# EAGLE design RCDongle (EAGLE 6.5.0)
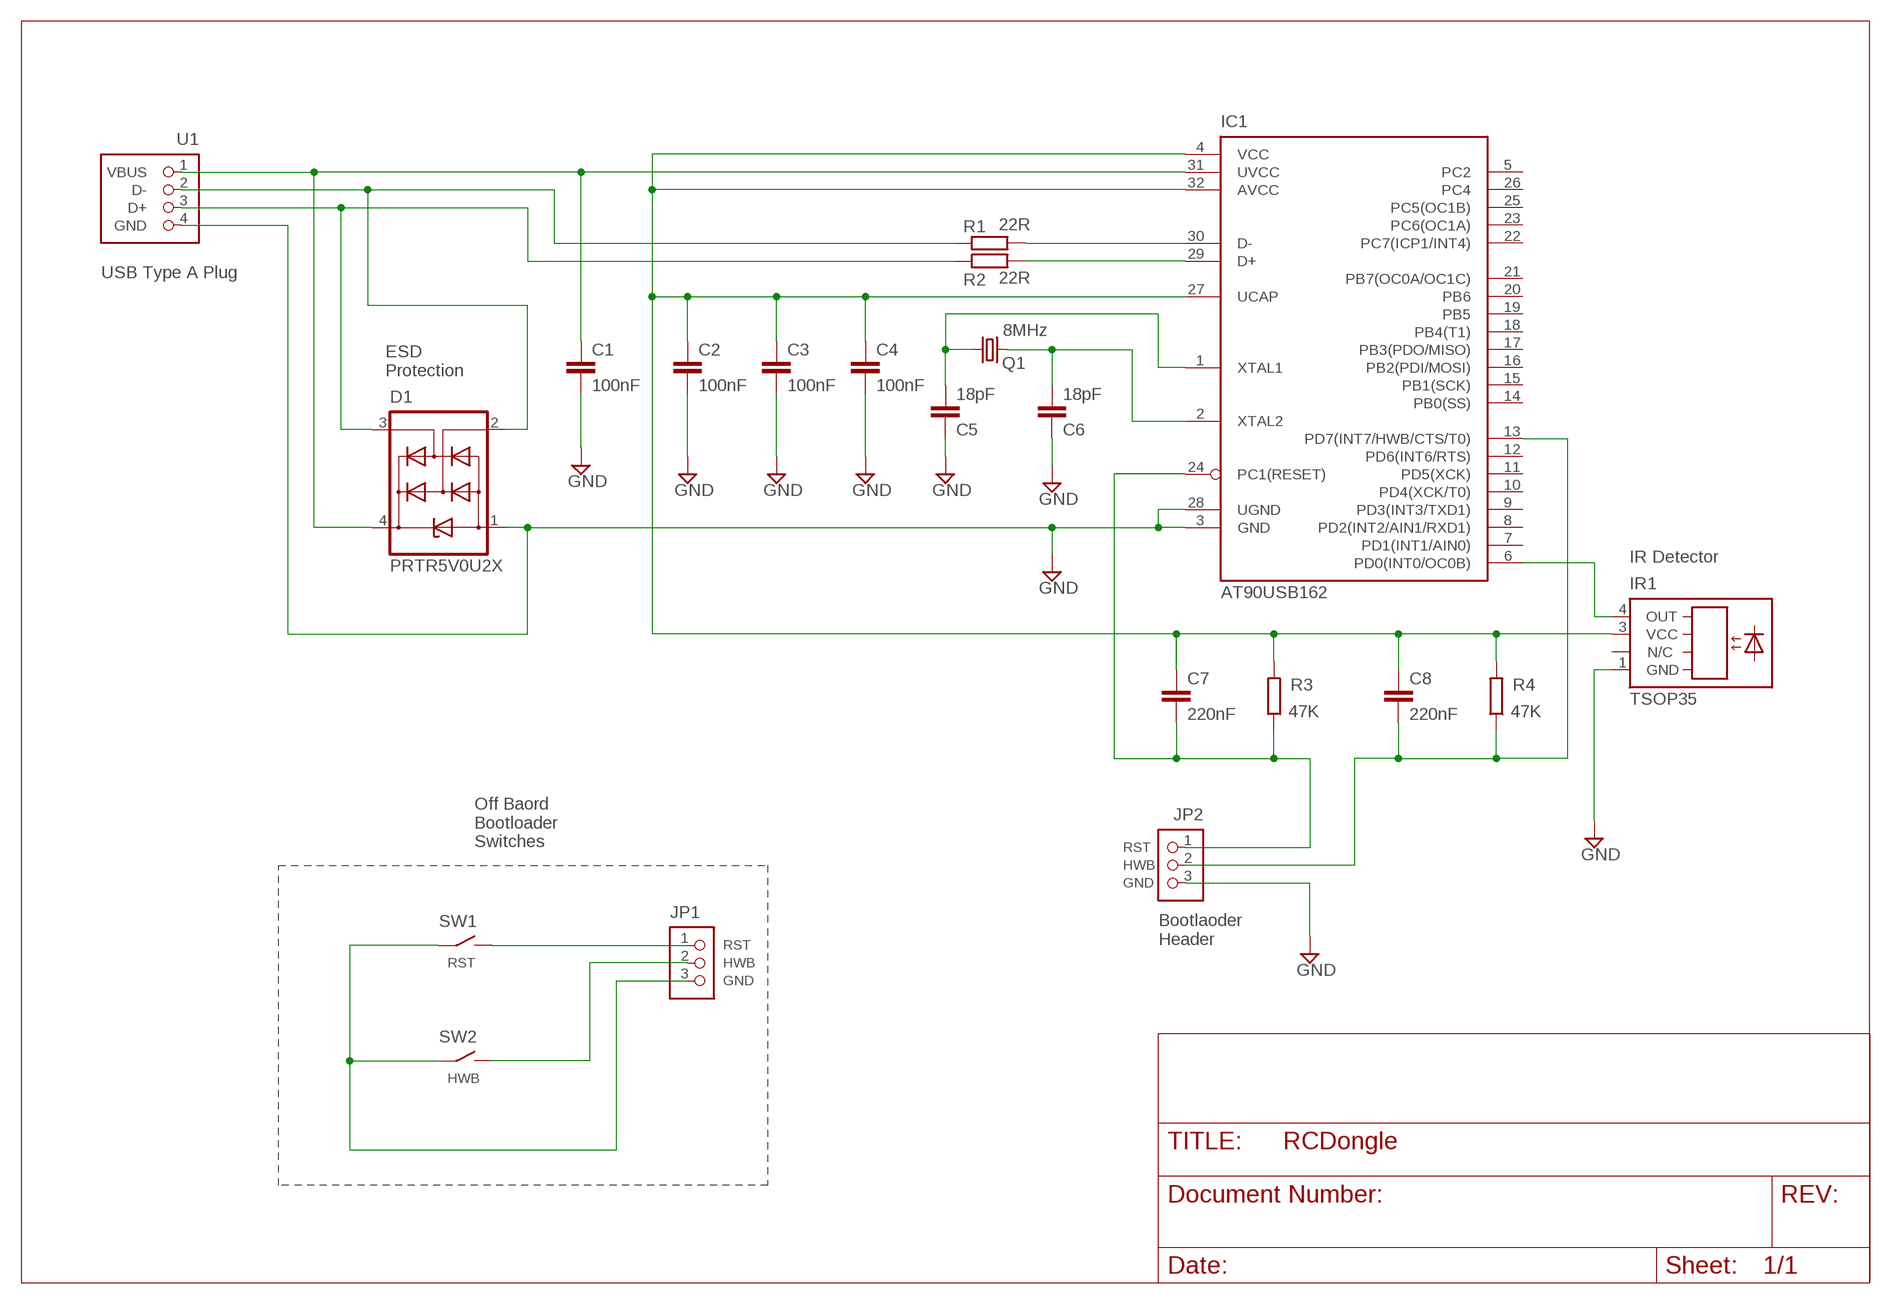
[diagram p0: schematic, sheet 1]

## Parts
C1  100nF  C-EUC0805  [C0805]
C2  100nF  C-EUC0805  [C0805]
C3  100nF  C-EUC0805  [C0805]
C4  100nF  C-EUC0805  [C0805]
C5  18pF  C-EUC0805  [C0805]
C6  18pF  C-EUC0805  [C0805]
C7  220nF  C-EUC0805  [C0805]
C8  220nF  C-EUC0805  [C0805]
D1  PRTR5V0U2X  [P-SOT143BE]
IC1  AT90USB162  [P-TQFP32]
IR1  TSOP35  [P-TSOP35]
JP1  HEADER-1X03  [P-1X03]
JP2  HEADER-1X03  [P-1X03]
Q1  8MHz  CSM-7X-DU  [CSM-7X-DU]
R1  22R  R-EU_M0805  [M0805]
R2  22R  R-EU_M0805  [M0805]
R3  47K  R-EU_M0805  [M0805]
R4  47K  R-EU_M0805  [M0805]
SW1  SWITCH-2PIN  [P-SWITCH-SMT-DTSM31NV]
SW2  SWITCH-2PIN  [P-SWITCH-SMT-DTSM31NV]
U1  USB-TYPEA-PLUG  [P-USB-TYPEA-PLUG]

## Nets
GND: C1.2 C2.2 C3.2 C4.2 C5.1 C6.1 D1.1 IC1.3(GND) IC1.28(UGND) IR1.1(GND) JP2.3 U1.4(GND)
N$1: C5.2 IC1.1(XTAL1) Q1.2
N$2: C6.2 IC1.2(XTAL2) Q1.1
N$3: IC1.30(D-) R1.2
N$4: IC1.29(D+) R2.2
N$5: JP1.1 SW1.2
N$6: JP1.2 SW2.2
N$7: D1.3 R2.1 U1.3(D+)
N$8: D1.2 R1.1 U1.2(D-)
N$9: C8.2 IC1.13(PD7(INT7/HWB/CTS/T0)) JP2.2 R4.1
N$10: C1.1 D1.4 IC1.31(UVCC) U1.1(VBUS)
N$11: C7.2 IC1.24(PC1(RESET)) JP2.1 R3.1
N$12: JP1.3 SW1.1 SW2.1
N$14: C2.1 C3.1 C4.1 C7.1 C8.1 IC1.4(VCC) IC1.27(UCAP) IC1.32(AVCC) IR1.3(VCC) R3.2 R4.2
N$30: IC1.6(PD0(INT0/OC0B)) IR1.4(OUT)
Unconnected: IC1.5(PC2) IC1.7(PD1(INT1/AIN0)) IC1.8(PD2(INT2/AIN1/RXD1)) IC1.9(PD3(INT3/TXD1)) IC1.10(PD4(XCK/T0)) IC1.11(PD5(XCK)) IC1.12(PD6(INT6/RTS)) IC1.14(PB0(SS)) IC1.15(PB1(SCK)) IC1.16(PB2(PDI/MOSI)) IC1.17(PB3(PDO/MISO)) IC1.18(PB4(T1)) IC1.19(PB5) IC1.20(PB6) IC1.21(PB7(OC0A/OC1C)) IC1.22(PC7(ICP1/INT4)) IC1.23(PC6(OC1A)) IC1.25(PC5(OC1B)) IC1.26(PC4)

## Notes on the sheet
- USB Type A Plug
- ESD
  Protection
- IR Detector
- Off Baord
  Bootloader
  Switches
- RST
- HWB
- GND
- RST
- Bootlaoder
  Header
- RST | HWB
- GND
- HWB

## Library data of the parts
C1-C8 = rcl:C-EU: CAPACITOR, European symbol
D1 = dn-electronics:PRTR5V0U2X: PRTR5V0U2X ESD Protection Diode Farnell - 1524157 RS - 7258720
IC1 = dn-electronics:AT90USB162: AT90USB162 TQFP32: Farnell - 1455073 TQFP32: RS - 7153750
IR1 = dn-electronics:TSOP35: TSOP35 IR Detector Farnell - 2251345 RS - 7103878
JP1 JP2 = dn-electronics:HEADER-1X03: Header 1x03 36 way single row: JPR - 710360
Q1 = crystal:CSM-7X-DU: SMD CRYSTAL Source: www.ecsxtal.com .. Crystal 3.6864MHz CSM_7X_DU.PDF; OC_FARNELL: unknown; OC_NEWARK: unknown
R1-R4 = resistor:R-EU_: RESISTOR, European symbol
SW1 SW2 = dn-electronics:SWITCH-2PIN: Switches 2 Pin SMT Tactile DTSM31NV: RS - 3786325
U1 = dn-electronics:USB-TYPEA-PLUG: USB Type A Plug Multicomp: Farnell - 1696546 Lumberg: RS - 7378795

## Board
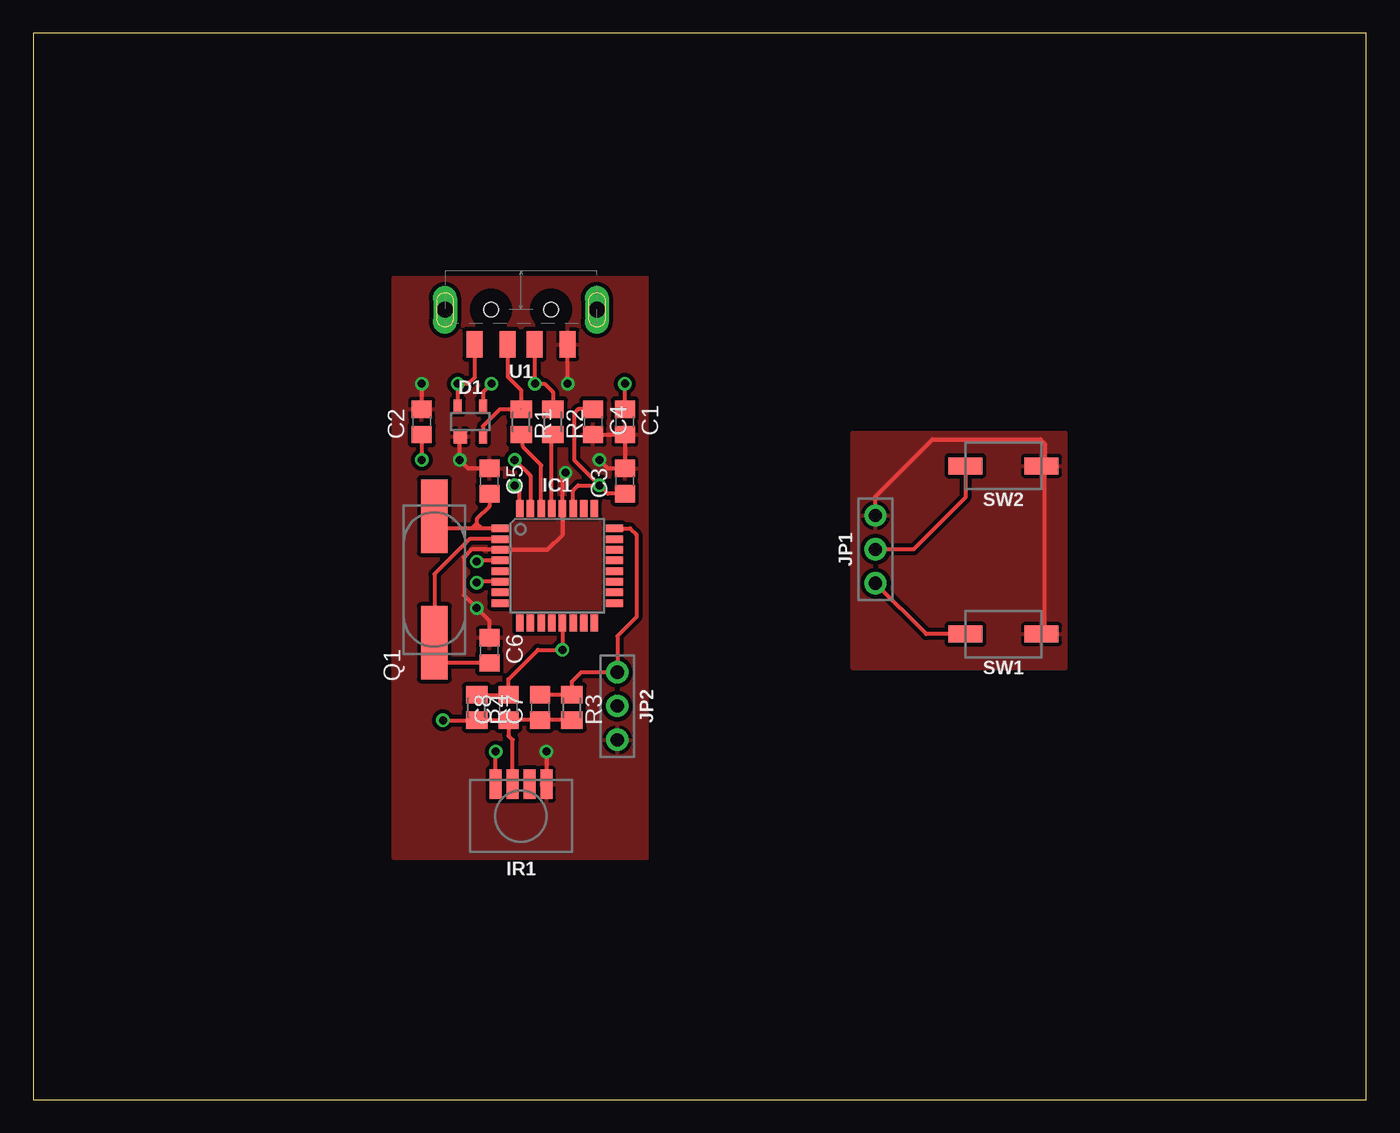
[diagram p1: board, top side]
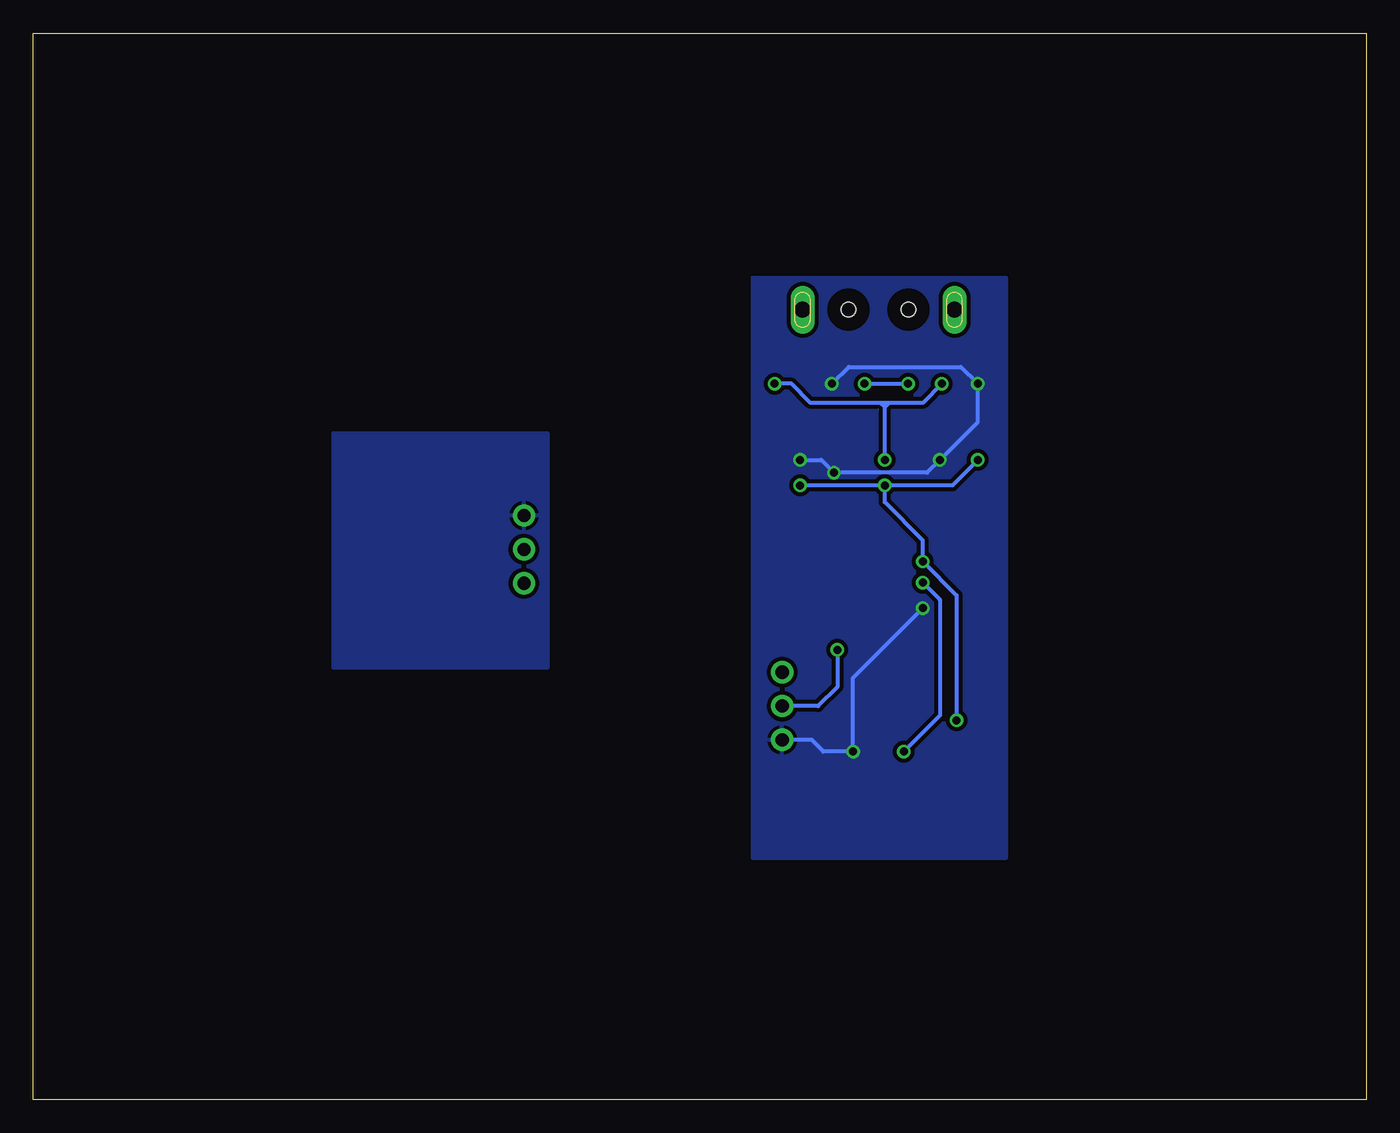
[diagram p2: board, bottom side, seen from below]

Size 100 x 80 mm. Coordinates in mm from the lower left corner, seen from the top.
Outline: 0,0 100,0 100,80 0,80 0,0
Copper layers (1*16): Top 0.035mm / dielectric 1.5mm / Bottom 0.035mm
Design rules "default *": minimum track width 10mil, minimum drill 0.5mm, track to track 8mil, track to pad 8mil, pad to pad 8mil, via to via 8mil, smd to smd 8mil, copper to edge 40mil, drill to drill 8mil, minimum pad ring 10mil, minimum via ring 8mil, stop-mask expansion 4mil, vias tented up to drill 0mil, thermal gap 10mil

### Footprints (pad centres in the part's own frame; a part is rotated, then mirrored left to right if it is on the bottom)
C0805 = smd 1.3 x 1.5: 1 -0.95,0; 2 0.95,0
P-SOT143BE = smd 1 x 1: 1 -0.75,-1.15 | smd 0.6 x 1: 2 0.95,-1.15; 3 0.95,1.15; 4 -0.95,1.15
P-TQFP32 = smd 1.27 x 0.559: 1 -4.293,2.8; 2 -4.293,2; 3 -4.293,1.2; 4 -4.293,0.4; 5 -4.293,-0.4; 6 -4.293,-1.2; 7 -4.293,-2; 8 -4.293,-2.8; 17 4.293,-2.8; 18 4.293,-2; 19 4.293,-1.2; 20 4.293,-0.4; 21 4.293,0.4; 22 4.293,1.2; 23 4.293,2; 24 4.293,2.8 | smd 0.559 x 1.27: 9 -2.8,-4.293; 10 -2,-4.293; 11 -1.2,-4.293; 12 -0.4,-4.293; 13 0.4,-4.293; 14 1.2,-4.293; 15 2,-4.293; 16 2.8,-4.293; 25 2.8,4.293; 26 2,4.293; 27 1.2,4.293; 28 0.4,4.293; 29 -0.4,4.293; 30 -1.2,4.293; 31 -2,4.293; 32 -2.8,4.293
P-TSOP35 = smd 0.9 x 2.2: 1 -1.905,-2.54; 2 -0.635,-2.54; 3 0.635,-2.54; 4 1.905,-2.54
P-1X03 = drill 1 pad 1.676: 1 -2.54,0; 2 0,0; 3 2.54,0
CSM-7X-DU = smd 5.5 x 2: 1 -4.75,0; 2 4.75,0
M0805 = smd 1.3 x 1.6: 1 -0.95,0; 2 0.95,0
P-SWITCH-SMT-DTSM31NV = smd 2.54 x 1.27: 1 -2.857,0; 2 2.857,0
P-USB-TYPEA-PLUG = smd 1.2 x 2: 1 3.5,4.3; 2 1,4.3; 3 -1,4.3; 4 -3.5,4.3 | drill 1.2 long: M1 5.7,1.7; M2 -5.7,1.7 | hole 1.1: -2.25,1.7; 2.25,1.7

### Placement (x,y rotation side)
C1  44.38,50.85 270 top
C2  29.14,50.85 90 top
C3  44.38,46.4 90 top
C4  42,50.85 270 top
C5  34.22,46.4 270 top
C6  34.22,33.7 270 top
C7  38.03,29.41 90 top
C8  35.65,29.41 90 top
D1  32.78,50.88 0 top
IC1  39.3,40.05 0 top
IR1  36.59,21.11 180 top
JP1  63.18,41.27 90 top
JP2  43.81,29.53 270 top
Q1  30.09,39.02 90 top
R1  36.6,50.85 270 top
R2  38.98,50.85 270 top
R3  40.41,29.41 270 top
R4  33.27,29.41 270 top
SW1  72.79,34.92 180 top
SW2  72.79,47.55 180 top
U1  36.59,60.96 180 top

### Tracks (layer width: path | path; a pad name or v marks a point on that pad's centre or on a via)
GND  (via drill 0.6)
  Top 0.305: C4.2 C1.2 C3.2 43.11,47.35 v42.47,47.99 | v29.14,53.7 C2.2 | v39.93,47.04 39.7,46.8 IC1.28 39.7,42.36 38.59,41.25 IC1.3 32.88,41.25 32.31,40.69 32.31,37.83 v33.27,36.88 34.22,35.92 C6.1 | C5.1 32.63,47.35 v32,47.99 | 40.09,56.52 U1.4 40.09,56.61 v40.09,53.7 | v32,47.99 32.03,47.99 | v32,47.99 32,49.84 D1.1 | v38.5,26.11 IR1.1
  Bottom 0.305: v42.47,47.99 40.89,47.99 v39.93,47.04 32.95,47.04 v32,47.99 29.14,50.85 v29.14,53.7 30.41,54.97 38.82,54.97 v40.09,53.7 | v33.27,36.88 38.5,31.65 v38.5,26.11 40.72,26.11 41.59,26.99 JP2.3
  pour Top (isolate 0.305): 27,61.64 27,18.14 46.05,18.14 46.05,61.64
  pour Bottom (isolate 0.305): 27,61.64 46.05,61.64 46.05,18.14 27,18.14
N$1
  Top 0.305: IC1.1 33.27,42.85 | 33.27,42.85 30.14,42.85 Q1.2 | C5.2 34.22,44.5 33.27,43.54 33.27,43.23 | 33.27,43.23 33.27,42.85 | 32.95,42.91 33.27,43.23 | 33.27,43.23 33.58,42.91
N$2
  Top 0.305: C6.2 29.78,32.75 29.77,32.75 Q1.1 30.09,39.42 32.73,42.05 IC1.2
N$3
  Top 0.305: IC1.30 38.1,47.6 36.76,48.94 R1.2
N$4
  Top 0.305: IC1.29 38.9,49.81 R2.2
N$5
  Top 0.305: SW1.2 66.99,34.92 JP1.1
N$6
  Top 0.305: SW2.2 69.93,45.16 66.04,41.27 JP1.2
N$7  (via drill 0.6)
  Top 0.305: v34.38,53.7 33.74,53.07 33.73,53.07 D1.3 | U1.3 37.63,56.57 v37.63,53.7 38.35,53.7 38.98,53.07 R2.1
  Bottom 0.305: v37.63,53.7 v34.38,53.7
N$8  (1 unrouted)
  Top 0.305: R1.1 35.01,51.8 33.74,50.53 33.73,50.53 D1.2 | U1.2 35.61,56.6 35.61,54.22 36.6,53.23 R1.1
N$9  (via drill 0.6)
  Top 0.305: R4.1 C8.2 35.65,31.52 37.86,33.73 v39.69,33.73 39.7,33.75 IC1.13
  Bottom 0.305: v39.69,33.73 39.69,30.96 41.12,29.53 JP2.2
N$10  (via drill 0.6)
  Top 0.305: C1.1 v44.38,53.7 | v36.12,47.99 37.3,46.81 IC1.31 | U1.1 33.11,56.56 33.11,54.18 32.63,53.7 v31.84,53.7 v31.83,53.7 D1.4
  Bottom 0.305: 35.81,52.27 33.27,52.27 v31.84,53.7 | 35.81,52.27 36.12,52.27 | 36.12,52.27 36.44,52.27 | 36.44,52.27 41.68,52.27 43.11,53.7 v44.38,53.7 | v36.12,47.99 36.12,51.96 | 36.12,51.96 36.12,52.27 | 35.81,52.27 36.12,51.96 | 36.12,51.96 36.44,52.27
N$11
  Top 0.305: C7.2 R3.1 40.41,31.36 41.12,32.07 JP2.1 43.81,34.77 44.93,35.88 45.01,35.96 45.24,36.2 45.24,42.39 44.78,42.85 IC1.24
N$12
  Top 0.305: 75.72,35.08 75.88,35.08 75.88,47.31 | JP1.3 63.18,45.24 67.47,49.53 75.56,49.53 75.88,49.21 75.88,47.78 SW2.1
  Top 0.406: SW1.1 75.64,35 75.72,35.08 75.88,34.92 | 75.88,47.31 SW2.1
  pour Top (isolate 0.305): 77.47,50.01 61.44,50.01 61.44,32.38 77.47,32.38
  pour Bottom (isolate 0.305): 77.47,50.01 61.44,50.01 61.44,32.38 77.47,32.38
N$14  (via drill 0.6)
  Top 0.305: R3.2 C7.1 C8.1 | IC1.32 36.5,45.71 v36.12,46.08 | C3.1 43.11,45.45 v42.47,46.08 | C4.1 40.88,51.8 40.57,51.48 40.57,47.99 v42.47,46.08 | IC1.27 40.5,45.7 40.89,46.08 v42.47,46.08 | C2.1 v29.14,47.99 | IC1.4 33.35,40.45 v33.27,40.37 | v30.73,28.46 R4.2 C8.1 | C8.1 35.65,27.3 35.96,26.99 IR1.3
  Bottom 0.305: v36.12,46.08 v42.47,46.08 | v36.12,46.08 36.12,44.81 33.27,41.96 v33.27,40.37 30.73,37.83 v30.73,28.46 | v29.14,47.99 31.04,46.08 v36.12,46.08
N$30  (via drill 0.6)
  Top 0.305: IC1.6 33.34,38.85 v33.27,38.78 | IR1.4 v34.69,26.11
  Bottom 0.305: v33.27,38.78 32,37.51 32,28.79 32.01,28.79 v34.69,26.11